# EasyEDA Pro project ProDoc_P1_2025-10-18.epro

# Schematic Schematic1
Board Name: Board1; Create Date: 2025-10-18; Page Name: P1; Project Name: Andrew 555PCB; Schematic Name: Schematic1; Update Date: 2025-10-18; Company: EasyEDA.com; Page Size: A4; Version: V1.0
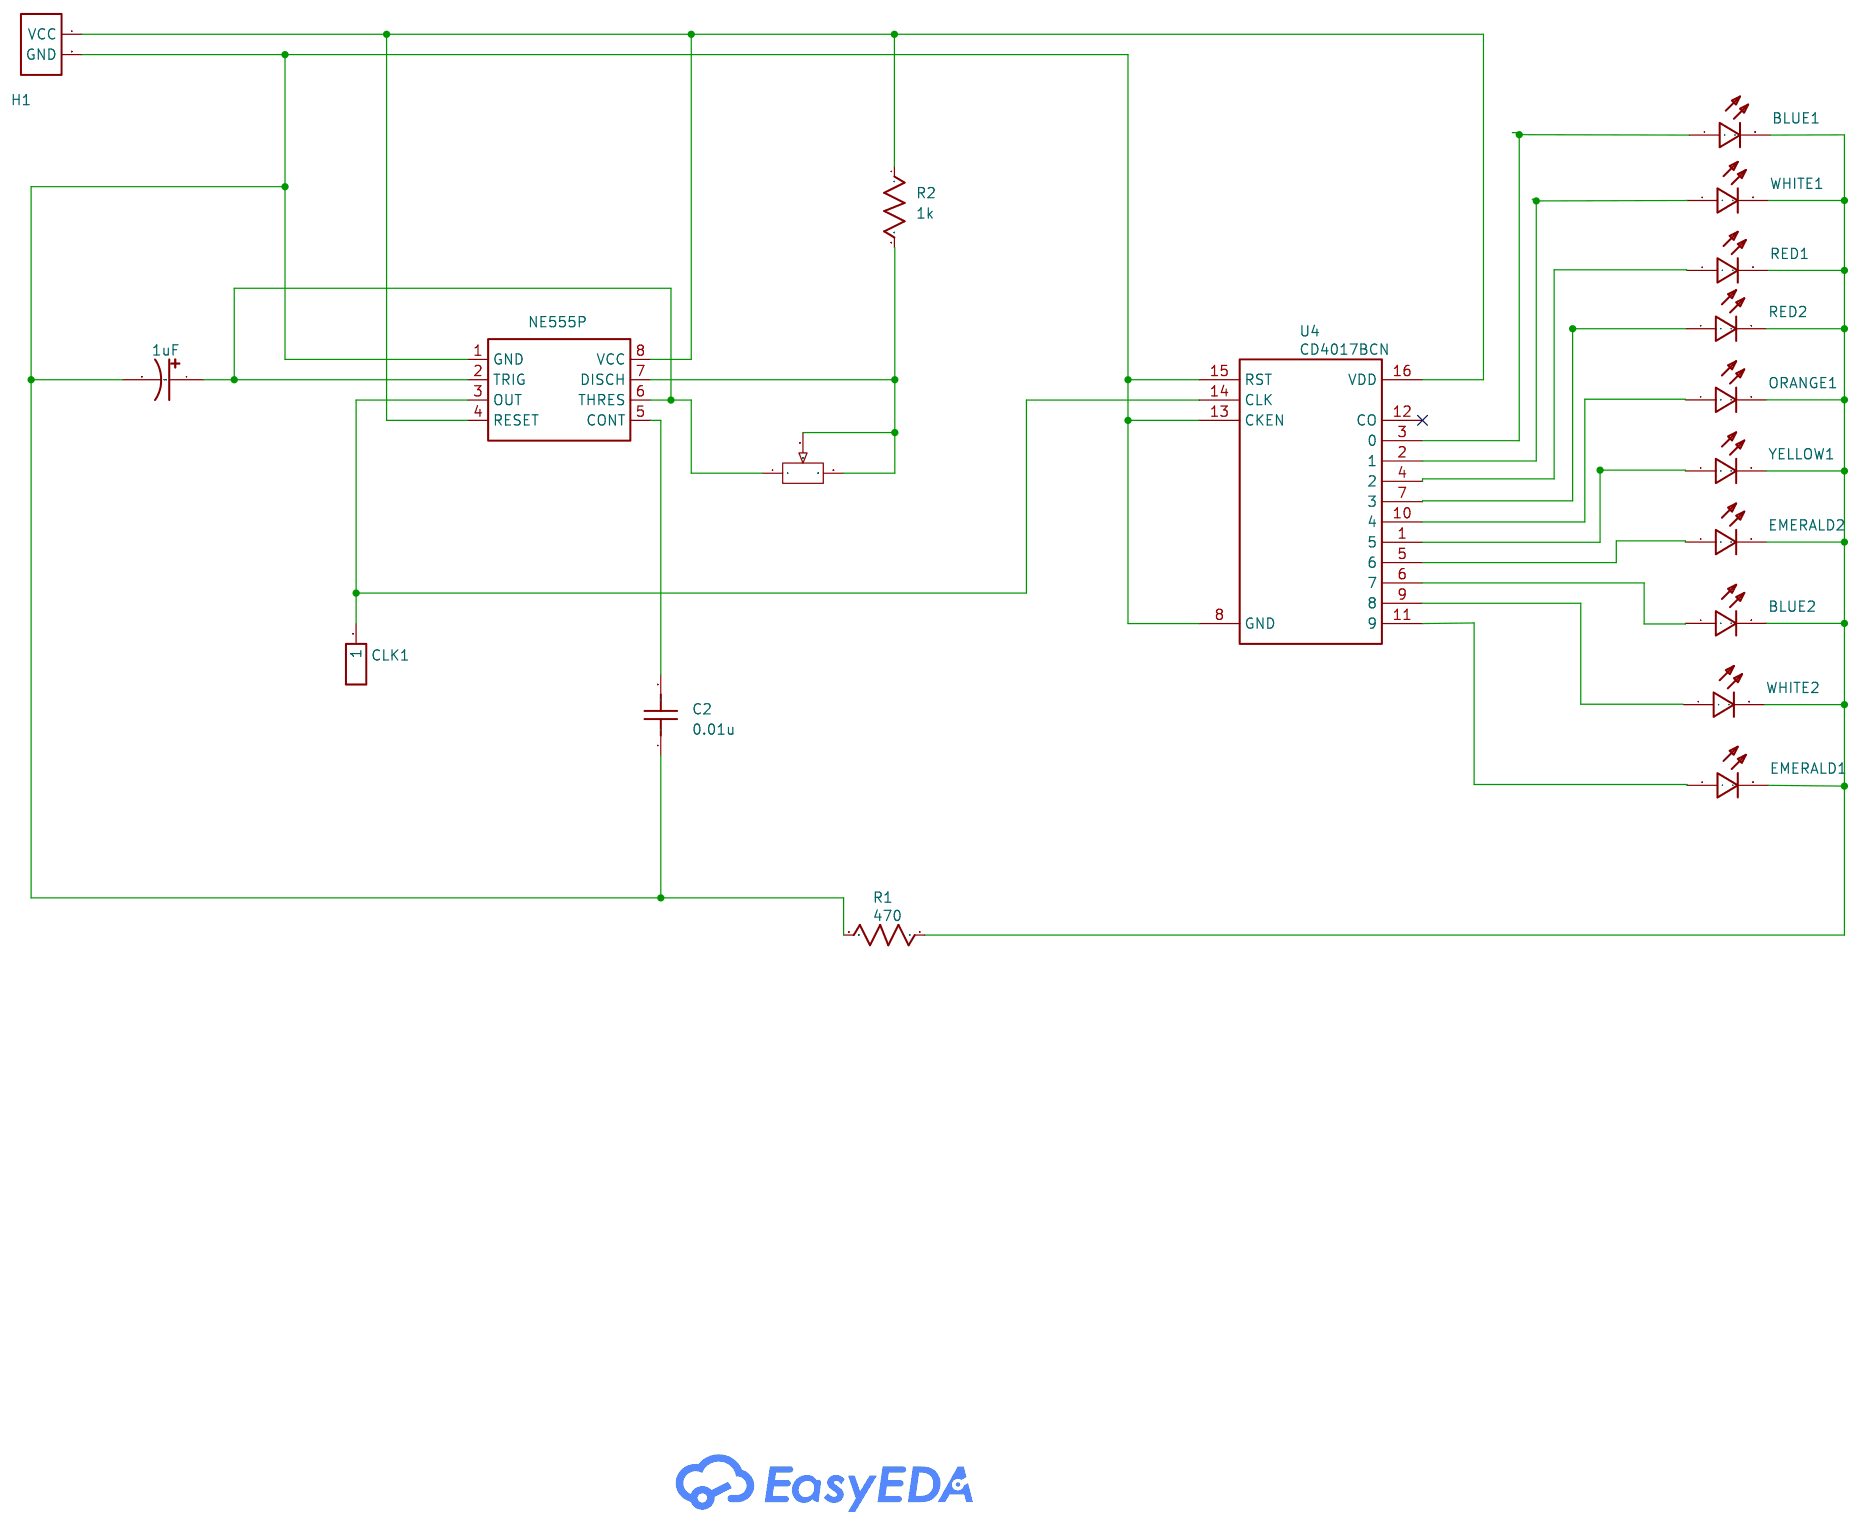
[diagram p0: schematic sheet]

## Parts
BLUE1  LED_5MM  [LED-TH_BD5.0-P2.54-FD_C9900023552]
BLUE2  LED_5MM  [LED-TH_BD5.0-P2.54-FD_C9900023552]
C1  1uF  [CAP-TH_BD5.0-P2.00-D0.8-FD]
C2  0.01u  [CAP-TH_L5.0-W2.1-P4.60-D0.4]
CLK1  C81276  [HDR-TH_1P-P2.54-V-M]
EMERALD1  LED_5MM  [LED-TH_BD5.0-P2.54-FD_C9900023552]
EMERALD2  LED_5MM  [LED-TH_BD5.0-P2.54-FD_C9900023552]
H1  H1  [HDR-M-2.54_1X2]
ORANGE1  LED_5MM  [LED-TH_BD5.0-P2.54-FD_C9900023552]
R1  470  [R_AXIAL-0.3]
R2  1k  [R_AXIAL-0.3]
R5  50kΩ  [RES-ADJ-TH_3P-L9.5-W4.85-P2.50-BL-L]
RED1  LED_5MM  [LED-TH_BD5.0-P2.54-FD_C9900023552]
RED2  LED_5MM  [LED-TH_BD5.0-P2.54-FD_C9900023552]
U2  NE555P  [DIP-8_L9.8-W6.6-P2.54-LS7.6-BL]
U4  CD4017BCN  [DIP-16_L19.8-W6.5-P2.54-LS7.6-BL]
WHITE1  LED_5MM  [LED-TH_BD5.0-P2.54-FD_C9900023552]
WHITE2  LED_5MM  [LED-TH_BD5.0-P2.54-FD_C9900023552]
YELLOW1  LED_5MM  [LED-TH_BD5.0-P2.54-FD_C9900023552]

## Library data of the parts
BLUE1 BLUE2 = LED_5MM: Supplier: LCSC; Supplier Part: C473834; Contributor: lcsc; spicePre: L
C1 = 1uF: Supplier: LCSC; Supplier Part: C62934; Manufacturer: Nichicon(尼吉康); Manufacturer Part: UVZ1H010MDD; nameAlias: Value; Contributor: LCSC; spicePre: C; spiceSymbolName: UVZ1H010MDD
C2 = 0.01u: Supplier Part: C249157; Supplier: LCSC; nameAlias: Value(F); Contributor: LCEDA_Lib; spicePre: C; spiceSymbolName: C_0603_US
CLK1 = C81276: Supplier: LCSC; Manufacturer Part: 2.54-1*1P针; JLCPCB Part Class: Extended Part; Manufacturer: BOOMELE(Boom Precision Elec); spicePre: P; spiceSymbolName: Header-Male-2.54_1x1; Package Display: No; Contributor: Thejo Prakash
EMERALD1 EMERALD2 = LED_5MM: Supplier: LCSC; Supplier Part: C2895483; Contributor: lcsc; spicePre: L
H1 = Header: Supplier: LCSC; Supplier Part: C492401; Contributor: nonstop2004; spicePre: H; spiceSymbolName: HEADER-FEMALE-2.54_1X2; Package Display: No
ORANGE1 = LED_5MM: Supplier: LCSC; Supplier Part: C779445; Contributor: lcsc; spicePre: L
R1 = 470: Manufacturer Part: ?; Supplier Part: C58592; Supplier: LCSC; nameAlias: Value(Ω); spicePre: R; spiceSymbolName: Resistor
R2 = 1k: Manufacturer Part: ?; Supplier Part: C713997; Supplier: LCSC; nameAlias: Value(Ω); spicePre: R; spiceSymbolName: Resistor
R5 = 3296X-1-503_C118912: Resistance:50kΩ Tolerance:±10% Tolerance:±10% Power(Watts):500mW Temperature Coefficient:±250ppm/℃ Temperature Coefficient:±250ppm/℃ Number of Turns:30; LCSC Part Name: 50kΩ ±10%; Supplier Part: C118912; Manufacturer: BOCHEN(博晨); Manufacturer Part: 3296X-1-503; Supplier Footprint: 插件-3P,9.5x4.9mm; JLCPCB Part Class: Extended Part; Datasheet: https://item.szlcsc.com/datasheet/3296X-1-503/120181.html; Supplier: LCSC; Tolerance: ±10%; Power(Watts): 500mW; Temperature Coefficient: ±250ppm/℃; Number of Turns: 30
RED1 RED2 = LED_5MM: Supplier: LCSC; Supplier Part: C2844743; Contributor: lcsc; spicePre: L
U2 = NE555P: Supplier: LCSC; Manufacturer: TI(德州仪器); Supplier Part: C46749; JLCPCB Part Class: Extended Part; nameAlias: Value; spicePre: U
U4 = CD4017BCN: Supplier: LCSC; Supplier Part: C32710674; spicePre: U
WHITE1 WHITE2 = LED_5MM: Supplier: LCSC; Supplier Part: C2895480; Contributor: lcsc; spicePre: L
YELLOW1 = LED_5MM: Supplier: LCSC; Supplier Part: C330770; Contributor: lcsc; spicePre: L

## Nets
Net-(BLUE1-1): BLUE1.1(A) U4.3(0)
Net-(BLUE1-2): BLUE1.2(K) BLUE2.2(K) EMERALD1.2(K) EMERALD2.2(K) ORANGE1.2(K) R1.1 RED1.2(K) RED2.2(K) WHITE1.2(K) WHITE2.2(K) YELLOW1.2(K)
Net-(BLUE2-1): BLUE2.1(A) U4.6(7)
Net-(C1-1): C1.1 R5.1 U2.2(TRIG) U2.6(THRES)
Net-(C1-2): C1.2 C2.1 H1.2(GND) R1.2 U2.1(GND) U4.8(GND) U4.13(CKEN) U4.15(RST)
Net-(C2-2): C2.2 U2.5(CONT)
Net-(CLK1-1): CLK1.1 U2.3(OUT) U4.14(CLK)
Net-(EMERALD1-1): EMERALD1.1(A) U4.11(9)
Net-(EMERALD2-1): EMERALD2.1(A) U4.5(6)
Net-(H1-1): H1.1(VCC) R2.1 U2.4(RESET) U2.8(VCC) U4.16(VDD)
Net-(ORANGE1-1): ORANGE1.1(A) U4.10(4)
Net-(R5-2): R5.2 R5.3 U2.7(DISCH)
Net-(RED2-1): RED2.1(A) U4.7(3)
Net-(U4-1): U4.1(5) YELLOW1.1(A)
Net-(U4-2): U4.2(1) WHITE1.1(A)

Not connected (* = marked no-connect by the designer): R2 2; RED1 1(A); U4 4(2) 9(8) 12(CO)*; WHITE2 1(A)
